# Altium schematic sheet DronePCB_2.SchDoc
size A; SheetNumber: 2; SheetTotal: 2; SPICEModelCacheAHKOHMFY: <root> / <DocumentId>AHKOHMFY</DocumentId> / <CacheFrame Number="0"> / <Model Name="irf1010" Kind="CKT"> / <Text>*IRF1010 MCE 4-2-96 / *55V  75A .014 ohm HEXFET pkg:TO-220 2,1,3 / .SUBCKT IRF1010  10 20 40 40 / M1   1  2  3  3  DMOS L=1U W=1U / RD  10  1  5.65M / RS  30  3  1.35M / RG  20  2  12.1 / CGS  2  3  2.15N / EGD 12  0  2  1  1 / VFB 14  0  0 / FFB  2  1  VFB  1 / CGD 13 14  4.49N / R1  13  0  1 / D1  12 13  DLIM / DDG 15 14  DCGD / R2  12 15  1 / D2  15  0  DLIM / DSD  3 10  DSUB / LS  30 40  7.5N / .MODEL DMOS NMOS (LEVEL=3 THETA=60M VMAX=114K ETA=2M VTO=3 KP=19.4) / .MODEL DCGD D (CJO=4.49N VJ=.6 M=.68) / .MODEL DSUB D (IS=311N N=1.5 RS=8.67M BV=55 CJO=4.08N VJ=.8 M=.42 TT=100N) / .MODEL DLIM D (IS=100U) / .ENDS IRF1010</Text> / </Model> / <Model Name="skydiode" Kind="MDL"> / <Text>*Default Schottky Diode / *Schottky Diode Pinout: A,K / .MODEL SKYDIODE D(EG=0.69 XTI=2)</Text> / </Model> / </CacheFrame> / </root>
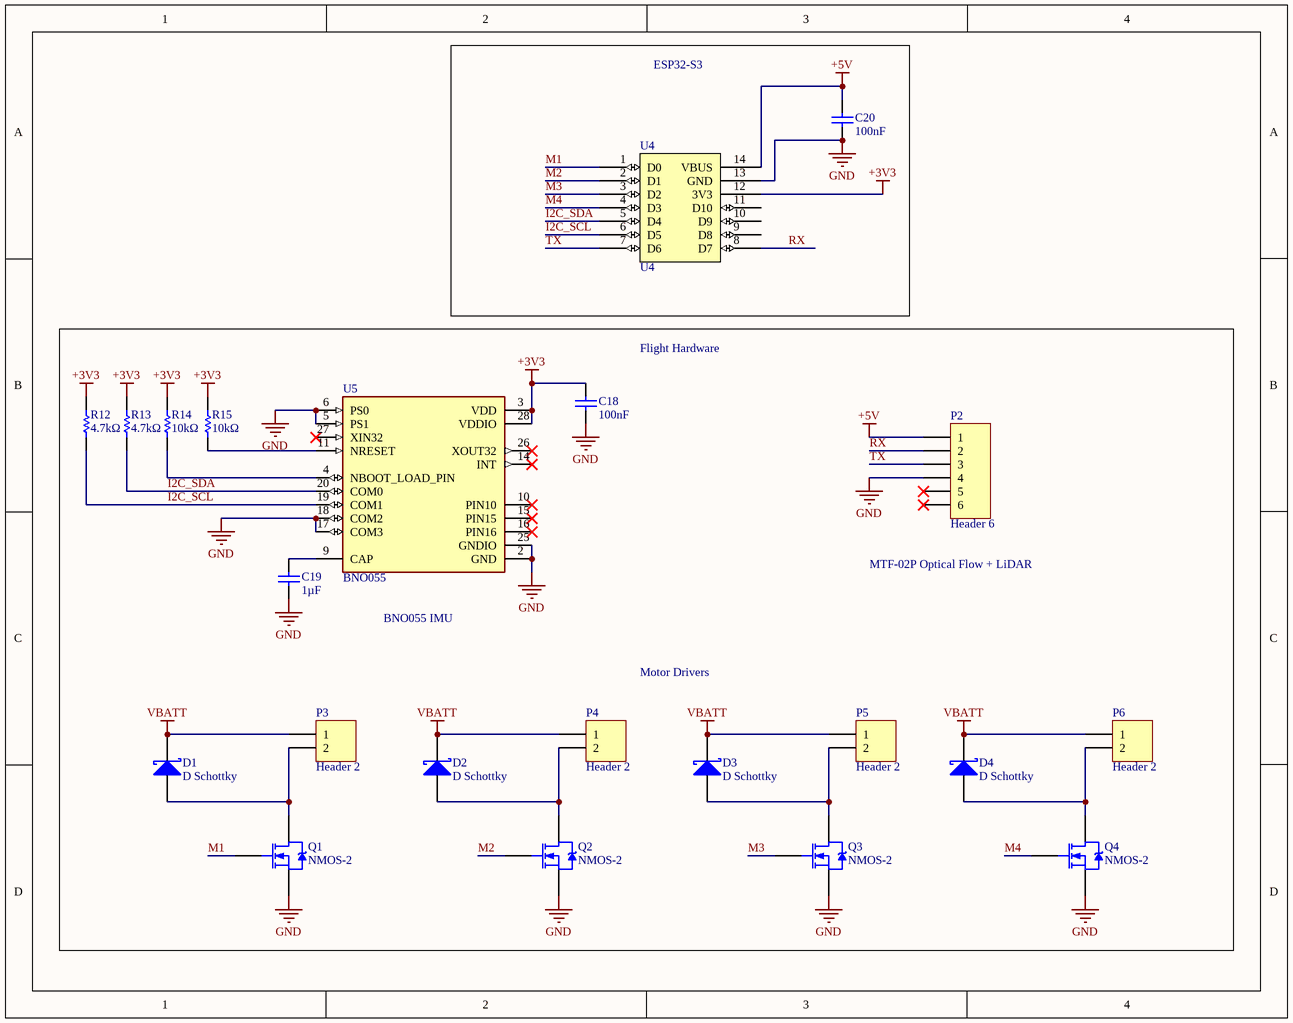
[diagram p0: DronePCB_2.SchDoc]

## Parts
C18  value 100nF  [RAD-0.3]  (hidden comment: Cap)
C19  value 1µF  [RAD-0.3]  (hidden comment: Cap)
C20  value 100nF  [RAD-0.3]  (hidden comment: Cap)
D1  D Schottky  [SMB]
D2  D Schottky  [SMB]
D3  D Schottky  [SMB]
D4  D Schottky  [SMB]
P2  Header 6  [HDR1X6]
P3  Header 2  [HDR1X2]
P4  Header 2  [HDR1X2]
P5  Header 2  [HDR1X2]
P6  Header 2  [HDR1X2]
Q1  NMOS-2  [TO-220AB]
Q2  NMOS-2  [TO-220AB]
Q3  NMOS-2  [TO-220AB]
Q4  NMOS-2  [TO-220AB]
R12  value 4.7kΩ  [AXIAL-0.3]  (hidden comment: Res1)
R13  value 4.7kΩ  [AXIAL-0.3]  (hidden comment: Res1)
R14  value 10kΩ  [AXIAL-0.3]  (hidden comment: Res1)
R15  value 10kΩ  [AXIAL-0.3]  (hidden comment: Res1)
U4  U4
U5  BNO055  [LGA28R50P4X10_380X520X100]

## Blocks framed on the sheet
ESP32-S3: C20 U4

## Nets
+3V3: C18.2 R12.2 R13.2 R14.1 R15.1 U4.12(3V3) U5.3(VDD) U5.28(VDDIO)
+5V: C20.2 P2.1 U4.14(VBUS)
GND: C18.1 C19.1 C20.1 P2.4 Q1.3(S) Q2.3(S) Q3.3(S) Q4.3(S) U4.13(GND) U5.2(GND) U5.5(PS1) U5.6(PS0) U5.17(COM3) U5.18(COM2) U5.25(GNDIO)
VBATT: D1.2(K) D2.2(K) D3.2(K) D4.2(K) P3.1 P4.1 P5.1 P6.1
I2C_SCL: R12.1 U4.6(D5) U5.19(COM1)
I2C_SDA: R13.1 U4.5(D4) U5.20(COM0)
M1: Q1.1(G) U4.1(D0)
M2: Q2.1(G) U4.2(D1)
M3: Q3.1(G) U4.3(D2)
M4: Q4.1(G) U4.4(D3)
RX: P2.2 U4.8(D7)
TX: P2.3 U4.7(D6)
NetC19_2: C19.2 U5.9(CAP)
NetD1_1: D1.1(A) P3.2 Q1.2(D)
NetD2_1: D2.1(A) P4.2 Q2.2(D)
NetD3_1: D3.1(A) P5.2 Q3.2(D)
NetD4_1: D4.1(A) P6.2 Q4.2(D)
NetR14_2: R14.2 U5.4(NBOOT_LOAD_PIN)
NetR15_2: R15.2 U5.11(NRESET)

Not connected (* = marked no-connect by the designer): P2 5* 6*; U4 9(D8) 10(D9) 11(D10); U5 10(PIN10)* 14(INT)* 15(PIN15)* 16(PIN16)* 26(XOUT32)* 27(XIN32)*

## Notes on the sheet
- Flight Hardware
- MTF-02P Optical Flow + LiDAR
- BNO055 IMU
- Motor Drivers

## Library data of the parts
C18-C20 = Cap: Capacitor; Published: 8-Jun-2000; LatestRevisionDate: 17-Jul-2002; LatestRevisionNote: Re-released for DXP Platform.; PackageReference: RAD-0.3; Publisher: Altium Limited; PackageDescription: Radial Cap, Thru-Hole; 2 Leads; 0.3 in Pin Spacing
D1-D4 = D Schottky: Schottky Diode; Published: 8-Jun-2000; LatestRevisionDate: 17-Jul-2002; LatestRevisionNote: Re-released for DXP Platform.; PackageReference: SMB; Publisher: Altium Limited; PackageDescription: DO-214-AA/SMB; 2 C-Bend Leads; Body 5.3 x 3.6 mm, inc. leads (LxW); Code_JEDEC: DO-214-AA
P2 = Header 6: Header, 6-Pin; LatestRevisionDate: 17-Jul-2002; LatestRevisionNote: Re-released for DXP Platform.; Publisher: Altium Limited
P3-P6 = Header 2: Header, 2-Pin; LatestRevisionDate: 17-Jul-2002; LatestRevisionNote: Re-released for DXP Platform.; Publisher: Altium Limited
Q1-Q4 = NMOS-2: N-Channel Power MOSFET; Note: Pin 2 is electrically connected to pin 4.; Published: 8-Jun-2000; LatestRevisionDate: 17-Jul-2002; LatestRevisionNote: Re-released for DXP Platform.; DatasheetVersion: PD-9.814; PackageVersion: Feb-1997; PackageReference: TO-220AB; Publisher: Altium Limited; PackageDescription: TO, Thru-Hole, Vertical, Heatsink Mounted; 3 In-Line Leads; Pitch 2.54 mm; ComponentLink1Description: Manufacturer Link; ComponentLink1URL: http://www.irf.com/
R12-R15 = Res1: Resistor; Published: 8-Jun-2000; LatestRevisionDate: 17-Jul-2002; LatestRevisionNote: Re-released for DXP Platform.; PackageReference: AXIAL-0.3; Publisher: Altium Limited; PackageDescription: Axial Device, Thru-Hole; 2 Leads; 0.3 in Pin Spacing
U4 = ESP32S3
U5 = BNO055: BNO055 9-axis Absolute Orientation Sensor ( SiP ) w/Sensors and Sensor Fusion; Package: None; Price: None; Value: *; MP: BNO055; Availability: Unavailable